# Altium schematic sheet Charger_Power_V01.SchDoc
size A4
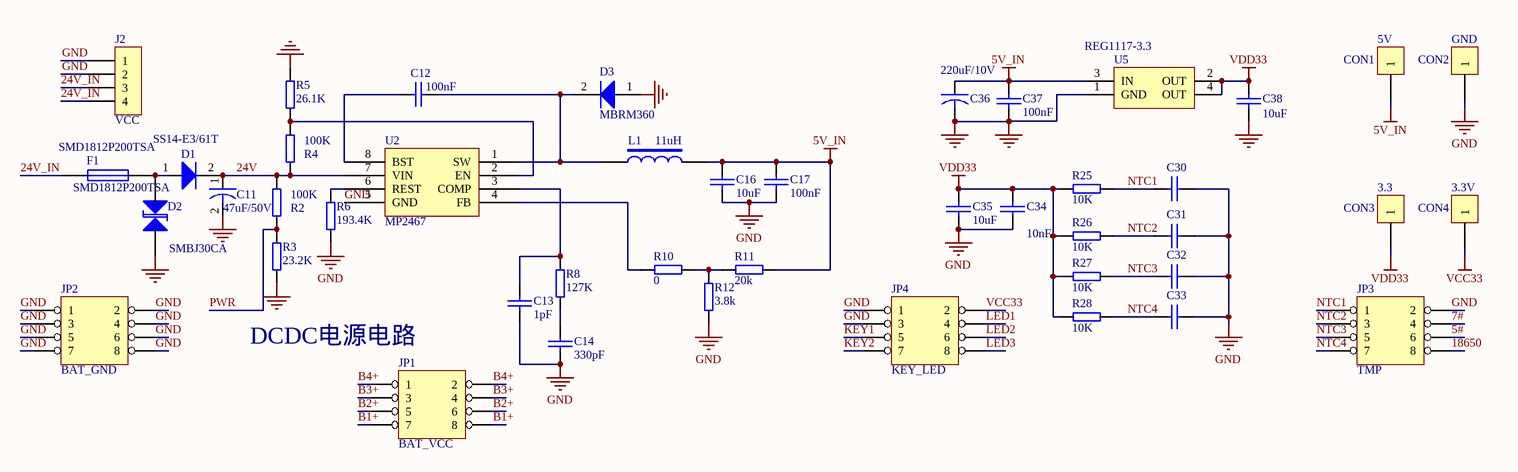
[diagram p0: Charger_Power_V01.SchDoc]

## Parts
3.3  CON3  [TP1]
3.3V  CON4  [TP1]
5V  CON1  [TP1]
C11  value 47uF/50V  [C1206]  (hidden comment: UUD1H470MCL1GS)
C12  value 100nF  [C0603]  (hidden comment: CC0603JRNPO9BN471)
C13  value 1pF  [C0603]  (hidden comment: CC0603JRNPO9BN471)
C14  value 330pF  [C0603]  (hidden comment: CC0603JRNPO9BN471)
C16  value 10uF  [C0805]  (hidden comment: CC0805ZKY5V6BB106)
C17  value 100nF  [C0603]  (hidden comment: CC0603JRNPO9BN471)
C30  C0603  [C0603]  (value not drawn)
C31  C0603  [C0603]  (value not drawn)
C32  C0603  [C0603]  (value not drawn)
C33  C0603  [C0603]  (value not drawn)
C34  value 10nF  [C0603]  (hidden comment: CC0603KRX7R9BB103)
C35  value 10uF  [C0805]  (hidden comment: CC0805ZKY5V6BB106)
C36  value 220uF/10V  [C6032]  (hidden comment: TAJC227K010RNJ)
C37  value 100nF  [C0603]  (hidden comment: CC0603ZRY5V9BB104)
C38  value 10uF  [C0805]  (hidden comment: CC0805ZKY5V6BB106)
D1  SS14-E3/61T  [D3528]
D2  SMBJ30CA  [D3528]
D3  value MBRM360  [D3528]  (hidden comment: SS14-E3/61T)
F1  SMD1812P200TSA  [R1812]
GND  CON2  [TP1]
J2  VCC  [SWIP4-2.54]
JP1  BAT_VCC  [IDC8(2.0mm)]
JP2  BAT_GND  [IDC8(2.0mm)]
JP3  TMP  [IDC8(2.0mm)]
JP4  KEY_LED  [IDC8(2.54mm)]
L1  value 11uH  [CD52]  (hidden comment: CD54NP-221KC)
R2  value 100K  [R0603]  (hidden comment: RC0603JR-071KL)
R3  value 23.2K  [R0603]  (hidden comment: RC0603JR-073KL)
R4  value 100K  [R0603]  (hidden comment: RC0603JR-071KL)
R5  value 26.1K  [R0603]  (hidden comment: RC0603JR-073KL)
R6  value 193.4K  [R0603]  (hidden comment: RC0603JR-073KL)
R8  value 127K  [R0603]  (hidden comment: RC0603JR-073KL)
R10  value 0  [R0603]  (hidden comment: RC0603JR-071KL)
R11  value 20k  [R0603]  (hidden comment: RC0603JR-071KL)
R12  value 3.8k  [R0603]  (hidden comment: RC0603JR-071KL)
R25  value 10K  [R0603]  (hidden comment: RC0603JR-0710KL)
R26  value 10K  [R0603]  (hidden comment: RC0603JR-0710KL)
R27  value 10K  [R0603]  (hidden comment: RC0603JR-0710KL)
R28  value 10K  [R0603]  (hidden comment: RC0603JR-0710KL)
U2  MP2467  [SO8]
U5  value REG1117-3.3  [SOT223]  (hidden comment: REG1117-3.3/2K5)

## Nets
5V_IN: 5V.1 C16.2 C17.1 C36.1 C37.2 L1.2 R11.1 U5.3(IN)
GND: C11.2 C13.1 C14.1 C16.1 C17.2 C30.1 C31.1 C32.1 C33.1 C34.2 C35.2 C36.2 C37.1 C38.2 D2.1 D3.1 GND.1 J2.1 J2.2 JP2.1 JP2.2 JP2.3 JP2.4 JP2.5 JP2.6 JP2.7 JP2.8 JP3.2 JP4.1 JP4.3 R3.1 R5.1 R6.2 R12.2 U2.5(GND) U5.1(GND)
VCC33: 3.3V.1 JP4.2
VDD33: 3.3.1 C34.1 C35.1 C38.1 R25.1 R26.1 R27.1 R28.1 U5.2(OUT) U5.4(OUT)
5#: JP3.6
7#: JP3.4
24V: C11.1 D1.2 R2.2 R4.1 U2.7(VIN)
24V_IN: F1.1 J2.3 J2.4
18650: JP3.8
B1+: JP1.7 JP1.8
B2+: JP1.5 JP1.6
B3+: JP1.3 JP1.4
B4+: JP1.1 JP1.2
KEY1: JP4.5
KEY2: JP4.7
LED1: JP4.4
LED2: JP4.6
LED3: JP4.8
NTC1: C30.2 JP3.1 R25.2
NTC2: C31.2 JP3.3 R26.2
NTC3: C32.2 JP3.5 R27.2
NTC4: C33.2 JP3.7 R28.2
PWR: R2.1 R3.2
NetC12_1: C12.1 U2.8(BST)
NetC12_2: C12.2 D3.2 L1.1 U2.1(SW)
NetC13_2: C13.2 R8.2 U2.3(COMP)
NetC14_2: C14.2 R8.1
NetD1_1: D1.1 D2.2 F1.2
NetR4_2: R4.2 R5.2 U2.2(EN)
NetR6_1: R6.1 U2.6(REST)
NetR10_1: R10.1 R11.2 R12.1
NetR10_2: R10.2 U2.4(FB)

## Notes on the sheet
- DCDC电源电路

## Library data of the parts
3.3 3.3V 5V GND = CON1: Connector
C11 = CAP_SMD_47uF/50V: CAP ALUM 47UF 50V 20% SMD; Manufacturer: Nichicon; Unit Cost: 0.3; Category: Capacitors; Manufacturer Part Number: UUD1H470MCL1GS; Part Number: UUD1H470MCL1GS; RoHs: Lead free / RoHS Compliant; Subcategory: Aluminum Capacitors
C12-C14 C17 = C0603_470p: CAP CER 470PF 50V 5% NPO 0603; Manufacturer: Yageo; Unit Cost: 0.04; Category: Capacitors; Manufacturer Part Number: CC0603JRNPO9BN471; Part Number: CC0603JRNPO9BN471; RoHs: Lead free / RoHS Compliant; Subcategory: Ceramic Capacitors
C16 C35 C38 = C0805_10uF: CAP CER 10UF 10V Y5V 0805; Manufacturer: Yageo; Unit Cost: 0.08; Category: Capacitors; Manufacturer Part Number: CC0805ZKY5V6BB106; Part Number: CC0805ZKY5V6BB106; RoHs: Lead free / RoHS Compliant; Subcategory: Ceramic Capacitors
C30-C33 = C0603: Unit Cost: 0.04
C34 = C0603_10nF: CAP CER 10000PF 50V 10% X7R 0603; Manufacturer: Yageo; Unit Cost: 0.04; Category: Capacitors; Manufacturer Part Number: CC0603KRX7R9BB103; Part Number: CC0603KRX7R9BB103; RoHs: Lead free / RoHS Compliant; Subcategory: Ceramic Capacitors
C36 = C6032_220uF_10V: CAP TANT 220UF 10V 10% 2312; Manufacturer: AVX Corporation; Unit Cost: 0.3; Category: Capacitors; Manufacturer Part Number: TAJC227K010RNJ; Part Number: TAJC227K010RNJ; RoHs: Lead free / RoHS Compliant; Subcategory: Tantalum Capacitors
C37 = C0603_100nF: CAP CER 0.1UF 50V Y5V 0603; Manufacturer: Yageo; Unit Cost: 0.04; Category: Capacitors; Manufacturer Part Number: CC0603ZRY5V9BB104; Part Number: CC0603ZRY5V9BB104; Subcategory: Ceramic Capacitors
D1 D3 = D3528_SS14: DIODE SCHOTTKY 40V 1A DO214AC; Manufacturer: Vishay; Unit Cost: 0.2; Category: Diodes; Manufacturer Part Number: SS14-E3/61T; Part Number: SS14-E3/61T; Subcategory: Diodes, Rectifiers - Single
  D1: Value: SS14-E3/61T
D2 = D3528_TVS_30: TVS DIODE 30VWM 48.4VC SMB; Manufacturer: Littelfuse Inc; Unit Cost: 0.3; Category: Circuit Protection; Manufacturer Part Number: SMBJ30CA; Part Number: SMBJ30CA; Subcategory: TVS - Diodes; Value: SMBJ30CA
F1 = FUSE1: FUSE RESETTABLE 2A  1812; Manufacturer: Littelfuse Inc; Unit Cost: 0.25; Category: Circuit Protection; Manufacturer Part Number: SMD1812P200TSA; Part Number: SMD1812P200TSA; Subcategory: Fuses; Value: SMD1812P200TSA
J2 = CON4: Connector
JP1 JP2 = HEADER 4X2-IDC8
JP3 = HEADER 4X2-IDC8: Value: NTC
JP4 = HEADER 4X2(2.54mm)
L1 = INDUCTOR_CD54: INDUCTOR POWER 220UH 10% SMD; Manufacturer: Sumida America Components Inc; Unit Cost: 0.4; Category: Inductors; Manufacturer Part Number: CD54NP-221KC; Part Number: CD54NP-221KC; Subcategory: Fixed Inductors
R2 R4 R10-R12 = R0603_1K_5%: RES 1.0K OHM 1/10W 5% 0603 SMD; Manufacturer: Yageo; Unit Cost: 0.005; Category: Resistor; Manufacturer Part Number: RC0603JR-071KL; Part Number: RC0603JR-071KL; RoHs: Lead free / RoHS Compliant; Subcategory: ThickFilm
R3 R5 R6 R8 = R0603_3K_5%: RES 3.0K OHM 1/10W 5% 0603 SMD; Manufacturer: Yageo; Unit Cost: 0.005; Category: Resistor; Manufacturer Part Number: RC0603JR-073KL; Part Number: RC0603JR-073KL; RoHs: Lead free / RoHS Compliant; Subcategory: ThickFilm
R25-R28 = R0603_10K_5%: RES 10K OHM 1/10W 5% 0603 SMD; Manufacturer: Yageo; Unit Cost: 0.005; Category: Resistor; Manufacturer Part Number: RC0603JR-0710KL; Part Number: RC0603JR-0710KL; RoHs: Lead free / RoHS Compliant; Subcategory: ThickFilm
U2 = MP2467: input range:6-36V; Manufacturer: Analog; Value: IN:6-36V;OUTmax:30V; Category: Integrated Circuits (ICs); Manufacturer Part Number: MP2467; Part Number: MP2467; Subcategory: IN:6-36V
U5 = REG1117-3.3: IC REG LDO 3.3V 0.8A SOT223; Manufacturer: Texas Instruments; Category: Integrated Circuits (ICs); Manufacturer Part Number: REG1117-3.3/2K5; Part Number: REG1117-3.3/2K5; RoHs: Lead free / RoHS Compliant; Subcategory: PMIC - Voltage Regulators - Linear (LDO)